# EasyEDA Pro project SCH_and_PCB.epro, board PCB_PCB_四路运放_2023-06-19
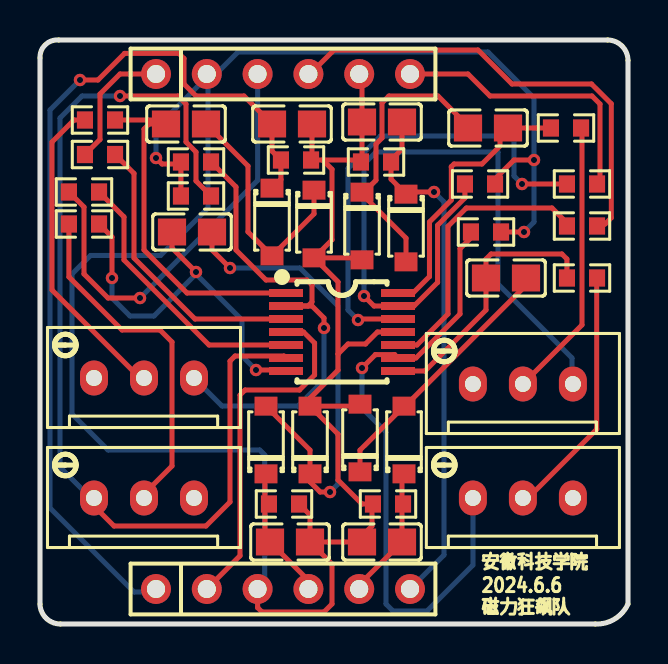
[diagram p14: board, top side]
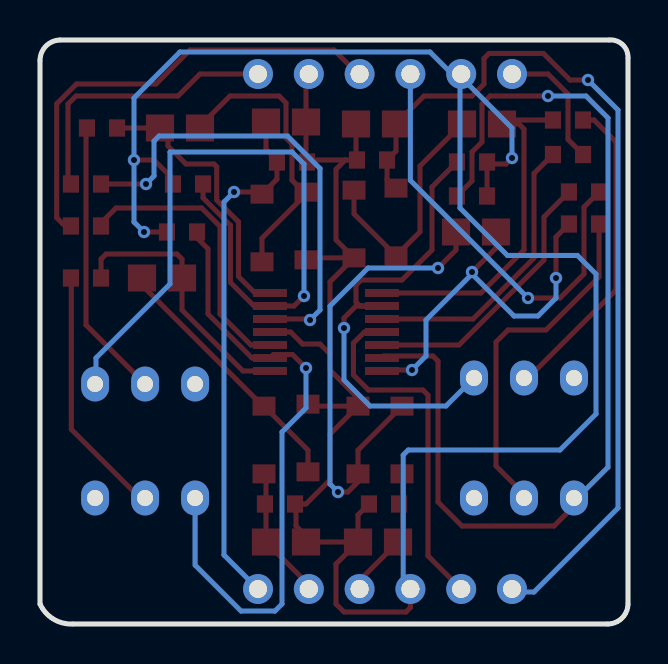
[diagram p15: board, bottom side, seen from below]

Outline 29.4 x 29.2 mm; copper layers: Top Layer, Bottom Layer. Coordinates in mm from the lower left corner of the outline.
Outline path: 0,28.3 arc(0.27,28.96) 0.94,29.2 28.39,29.2 arc(29.1,28.9) 29.4,28.18 29.4,1 arc(28.74,0.25) 27.77,0 1.02,0 arc(0.31,0.29) 0,1 0,28.3
Stack: Top Layer 0.035mm / Dielectric1 1.51mm FR4 er 4.5 / Bottom Layer 0.035mm

## Design rules (mm)
spacing Default (default): track to track 0.152, other pairs 0 to 0.152
track width Default (default): min 0.152, default 0.152, max 25.4
differential pair differentialPair (default): width min 0.127, default 0.254, max 2.54; gap min 0.152, default 0.152
via Default (default): diameter min 0.62, default 0.62, max 100.025; hole min 0.305, default 0.305, max 59.995
net GND uses gge8511

## Placement (name value [footprint] x y rotation side)
C1  104  [C0805]  7.3 25 0 top
C2  104  [C0805]  12.6 25 180 top
C3  104  [C0805]  7.6 19.6 180 top
C4  104  [C0805]  12.5 4.1 180 top
C5  104  [C0805]  23.3 17.3 0 top
C6  104  [C0805]  17.1 4.1 180 top
C7  104  [C0805]  22.4 24.8 0 top
C8  104  [C0805]  17.1 25.1 180 top
D1  B5819W  [SOD-123_L2.8-W1.8-LS3.7-RD]  11.6 20.1 270 top
D2  B5819W  [SOD-123_L2.8-W1.8-LS3.7-RD]  13.7 20 270 top
D3  B5819W  [SOD-123_L2.8-W1.8-LS3.7-RD]  11.3 9.2 90 top
D4  B5819W  [SOD-123_L2.8-W1.8-LS3.7-RD]  13.5 9.2 90 top
D5  B5819W  [SOD-123_L2.8-W1.8-LS3.7-RD]  18.2 9.2 90 top
D6  B5819W  [SOD-123_L2.8-W1.8-LS3.7-RD]  16 9.3 90 top
D7  B5819W  [SOD-123_L2.8-W1.8-LS3.7-RD]  18.3 19.8 270 top
D8  B5819W  [SOD-123_L2.8-W1.8-LS3.7-RD]  16.1 19.9 270 top
P1  Header-D-M 1x6P  [HDR1X6-M]  5.8 27.5 0 top
P2  Header-D-M 1x6P  [HDR1X6-M]  5.8 1.75 0 top
R1  5.1K  [R0603]  3 23.47 0 top
R2  1K  [R0603]  7.8 23.1 0 top
R3  47K  [R0603]  3 25.2 0 top
R4  47k  [R0603]  12.8 23.2 180 top
R5  5.1k  [R0603]  2.2 21.6 0 top
R6  1k  [R0603]  7.8 21.4 0 top
R7  47k  [R0603]  2.2 20 0 top
R8  47K  [R0603]  12.2 6 180 top
R9  5.1K  [R0603]  27.1 19.9 0 top
R10  1K  [R0603]  22.3 19.6 0 top
R11  47K  [R0603]  27.1 17.3 0 top
R12  47k  [R0603]  17.4 6 180 top
R13  5.1K  [R0603]  27.1 22 0 top
R14  1K  [R0603]  22 22 0 top
R15  47k  [R0603]  26.3 24.8 0 top
R16  47k  [R0603]  16.8 23.1 180 top
RP1  100K  [RES-ADJ-TH_3296W-1-203]  5.2 12.3 180 top
RP2  100K  [RES-ADJ-TH_3296W-1-203]  5.2 6.3 180 top
RP3  100K  [RES-ADJ-TH_3296W-1-203]  24.14 12 180 top
RP4  100K  [RES-ADJ-TH_3296W-1-203]  24.14 6.3 180 top
U2  OPA4377AIPW  [TSSOP-14_L5.0-W4.4-P0.65-LS6.4-BL]  15.1 14.6 270 top

## Footprints (pads in the part's own frame, mm; a bottom-side part is the same pattern mirrored in y, then rotated)
C0805
  rect 1.41x1.35 smd: 1(-1,0) 2(1,0)
HDR1X6-M
  round 1.5 hole 0.905x0.9: 1(0,0) 2(2.54,0) 3(5.08,0) 4(7.62,0) 5(10.16,0) 6(12.7,0)
R0603
  rect 0.806x0.864 smd: 1(-0.753,0) 2(0.753,0)
RES-ADJ-TH_3296W-1-203
  oval 1.4x1.75 hole 0.8: 1(-2.5,0) 2(0,0) 3(2.5,0)
SOD-123_L2.8-W1.8-LS3.7-RD
  rect 0.95x1.15 smd: 1(-1.692,0) 2(1.692,0)
TSSOP-14_L5.0-W4.4-P0.65-LS6.4-BL
  rect 0.4x1.7 smd: 1(-1.95,-2.8) 2(-1.3,-2.8) 3(-0.65,-2.8) 4(0,-2.8) 5(0.65,-2.8) 6(1.3,-2.8) 7(1.95,-2.8) 8(1.95,2.8) 9(1.3,2.8) 10(0.65,2.8) 11(0,2.8) 12(-0.65,2.8) 13(-1.3,2.8) 14(-1.95,2.8)

## Nets
+5V: P2.2 U2.4
GND: C2.1 C4.1 C6.2 C8.2 D2.2 D4.2 D6.2 D8.2 P1.2 P1.5 P2.3 R2.1 R4.1 R6.1 R8.1 R10.2 R12.2 R14.2 R16.2 U2.11
C1_2: C1.2 D1.2 D2.1
C5_2: C5.2 D5.2 D6.1
D3_2: C3.1 D3.2 D4.1
D7_2: C7.1 D7.2 D8.1
IN1: P1.1 R1.1
IN2: P1.3 R5.1
IN3: P1.4 R9.2
IN4: P1.6 R13.2
OPA1: C1.1 R3.2 U2.1
OPA2: R2.2 RP1.1 U2.2
OPA3: R1.2 U2.3
OPA5: R5.2 U2.5
OPA6: R6.2 RP2.3 U2.6
OPA7: C3.2 R7.2 U2.7
OPA8: C5.1 R11.1 U2.8
OPA9: R10.1 RP4.3 U2.9
OPA10: R9.1 U2.10
OPA12: R13.1 U2.12
OPA13: R14.1 RP3.1 U2.13
OPA14: C7.2 R15.1 U2.14
OUT1: C2.2 D1.1 P2.1 R4.2
OUT2: C4.2 D3.1 P2.4 R8.2
OUT3: C6.1 D5.1 P2.5 R12.1
OUT4: C8.1 D7.1 P2.6 R16.1
RP1_2: R3.1 RP1.2
RP2_2: R7.1 RP2.2
RP3_2: R15.2 RP3.2
RP4_2: R11.2 RP4.2

Pads without a net: RP1 3; RP2 1; RP3 3; RP4 1

## Via types
v1: diameter 0.62, hole 0.305, Top Layer to Bottom Layer, 17 vias

## Routing (per net, layer and track width the routed paths; a pad name or vN(x,y) marks a point on that pad's centre or on a via; arc(x,y) is an arc through that point)
+5V: length 17.8
  Top Layer w0.254: P2.2 10,3.41 10,11.45 10.25,11.7 12.97,11.7 13.73,12.45 13.73,14.05 13.17,14.6 U2.4
GND: length 128.3
  Top Layer w0.254: P2.3 10.88,0.82 11.1,0.6 14.2,0.6 14.6,1 14.6,3 C4.1 ; 12.95,6 13.5,5.45 C4.1 ; v1(5.8,23.3) 6.1,23 6.95,23 R2.1 R6.1 ; 22.75,22 22.75,22.25 23.7,23.2 v1(24.7,23.2) ; 16.1,27.16 C8.2 16.1,23.25 16.05,23.2 R16.2 15.95,23.2 14.13,23.2 ; 14.13,23.2 14.6,22.73 14.6,19.21 D2.2 ; 14.13,23.2 13.55,23.2 13.6,23.25 C2.1 ; 14.9,13.5 15.4,14 16.27,14 16.87,14.6 U2.11 ; 14.9,13.5 14.9,12.69 13.5,11.29 D4.2 ; 14.9,13.5 14.9,17.11 D2.2 ; C4.1 C6.2 16.1,4.4 16.6,4.9 16.6,5.75 16.85,6 16.1,6 14.9,7.2 14.9,9.49 D4.2 ; D4.2 15.9,10.89 D6.2 ; v1(24.2,19.6) 23.45,19.6 ; D2.2 15.9,18.31 16.1,18.11
  Bottom Layer w0.254: v1(5.8,23.3) 5.8,24.8 8.34,27.34 P1.2 ; P2.3 11.24,2.11 11.24,8.45 10.99,8.7 3.4,8.7 1.6,10.5 1.6,17.5 2.53,18.43 6.03,18.43 8.4,20.8 8.4,27.1 9.9,28.6 22.4,28.6 24.7,26.3 v1(24.7,23.2) 24.7,20.1 v1(24.2,19.6)
C1_2: length 12.1
  Top Layer w0.254: C1.2 10.4,22.9 10.4,19.61 D1.2 13.7,20.51 D2.1
C5_2: length 13.2
  Top Layer w0.254: C5.2 24.2,17.2 24.2,16.84 18.25,10.89 D5.2 16,8.69 D6.1
D3_2: length 23.7
  Top Layer w0.254: v1(9.5,17.8) 8.6,18.7 C3.1 ; v1(14.5,6.6) 14.01,6.6 13.5,7.11 D4.1 13.5,8.69 D3.2
  Bottom Layer w0.254: v1(14.5,6.6) 14.9,7 14.9,15.9 13,17.8 v1(9.5,17.8)
D7_2: length 14.4
  Top Layer w0.254: D7.2 18.3,19.29 16.1,21.49 16.8,22.19 16.8,24 17.1,24.3 17.1,26.05 17.45,26.4 19.9,26.4 21.4,24.9 C7.1
IN1: length 6.6
  Top Layer w0.254: P1.1 4,27.5 3,26.5 3,24.23 R1.1
IN2: length 21.3
  Top Layer w0.254: R5.1 2.2,20.85 2.2,17.5 3.4,16.3 v1(5,16.3)
  Bottom Layer w0.254: v1(5,16.3) 10.88,22.18 P1.3
IN3: length 22.9
  Top Layer w0.254: 28.15,20 28.25,20 28.56,20.31 28.56,26.01 27.57,27 23.6,27 21.9,28.7 14.7,28.7 13.5,27.5
IN4: length 14.3
  Top Layer w0.254: P1.6 21.4,27.5 22.5,26.4 27.6,26.4 28,26 28,21.85
OPA1: length 17.9
  Top Layer w0.254: U2.1 7.35,16.55 5.2,18.7 5.2,24.75 5.45,25 C1.1 6.1,25.2 R3.2
OPA2: length 24.8
  Top Layer w0.254: R2.2 9.8,21.85 9.8,18.7 11.3,17.2 13.35,17.2 13.6,16.95 13.6,16.1 13.4,15.9 U2.2 13.6,15.9 14.2,15.3 v1(14.2,14.8)
  Bottom Layer w0.254: 7.5,12.5 9.1,10.9 12.9,10.9 14.2,12.2 v1(14.2,14.8)
OPA3: length 14.4
  Top Layer w0.254: U2.3 7.75,15.25 4.7,18.3 4.7,22.53 R1.2
OPA5: length 13.8
  Top Layer w0.254: R5.2 4.2,20.35 4.2,18.2 8.45,13.95 U2.5
OPA6: length 50.1
  Top Layer w0.254: 2.7,6.5 2.7,5.9 3.7,4.9 8.3,4.9 9.5,6.1 9.5,13.15 9.75,13.4 12.2,13.4 U2.6 ; R6.2 7.8,22.15 7.8,23.6 7.3,24.1 7.3,26 6.9,26.4 v1(4,26.4)
  Bottom Layer w0.254: 2.7,6.5 2.34,6.5 1,7.84 1,25.3 2.1,26.4 v1(4,26.4)
OPA7: length 19.6
  Top Layer w0.254: v1(3.6,17.3) 3.6,19.35 R7.2 ; U2.7 12.25,12.7 v1(10.8,12.7) ; C3.2 6.6,18.8 v1(7.8,17.6)
  Bottom Layer w0.254: v1(3.6,17.3) 3.6,16.3 4.5,15.4 5.7,15.4 7.8,17.5 ; 7.8,17.5 10.1,15.2 10.1,13.4 v1(10.8,12.7) ; 7.8,17.5 v1(7.8,17.6)
OPA8: length 13.4
  Top Layer w0.254: R11.1 26.35,18.25 26.09,18.5 22.55,18.5 22.3,18.25 C5.1 22.3,15.7 19.25,12.65 U2.8
OPA9: length 31.7
  Top Layer w0.254: 21.65,19.7 R10.1 21.55,19.31 21,18.76 21,15.5 18.8,13.3 U2.9 17.73,13.47 16.77,13.47 v1(16.1,12.8)
  Bottom Layer w0.254: v1(16.1,12.8) 16.1,10.8 17.3,9.6 17.3,1 17.65,0.65 19.35,0.65 21.65,2.95 RP4.3
OPA10: length 14.2
  Top Layer w0.254: U2.10 18.85,13.95 20.4,15.5 20.4,19.88 21.32,20.8 25.6,20.8 26.4,20
OPA12: length 23.3
  Top Layer w0.254: v1(24.1,22) 26.25,22 ; v1(15.9,15.2) 15.95,15.25 U2.12
  Bottom Layer w0.254: v1(15.9,15.2) 15.4,15.7 15.4,22.77 17.03,24.4 23.45,24.4 23.7,24.15 23.7,22.4 v1(24.1,22)
OPA13: length 36.2
  Top Layer w0.254: R14.1 21.25,21.3 19.88,19.94 19.88,17.08 18.7,15.9 U2.13 16.7,15.9 v1(16.2,16.4)
  Bottom Layer w0.254: 26.9,12.5 26.6,12.8 26.6,13.3 22.9,17 22.9,23.6 16.8,23.6 16.2,23 v1(16.2,16.4)
OPA14: length 13.9
  Top Layer w0.254: U2.14 18.65,16.55 19.47,17.37 19.47,20.11 20.56,21.2 20.56,22.86 20.7,23 22.1,23 23,23.9 23,24.4 C7.2 R15.1
OUT1: length 45.4
  Top Layer w0.254: v1(2,27.2) 2.9,27.2 4.23,28.53 6.95,28.53 7.2,28.28 7.2,27 7.8,26.4 10.2,26.4 C2.2 11.6,23.65 R4.2 12.05,22.24 D1.1
  Bottom Layer w0.254: P2.1 5.95,1.6 4.7,1.6 0.5,5.8 0.5,25.7 v1(2,27.2)
OUT2: length 6.7
  Top Layer w0.254: P2.4 13.42,2.18 C4.2 11.25,4.35 11.25,7.45 D3.1
OUT3: length 6.7
  Top Layer w0.254: P2.5 15.96,1.96 C6.1 18.1,7.41 D5.1
OUT4: length 26.4
  Top Layer w0.254: C8.1 18.1,23.75 17.55,23.2 17.55,22.24 D7.1 18.41,21.6 v1(19.7,21.6)
  Bottom Layer w0.254: v1(19.7,21.6) 20.2,21.1 20.2,3.45 P2.6
RP1_2: length 15.9
  Top Layer w0.254: R3.1 1.7,25.2 0.6,24.1 0.6,16.7 5,12.3 RP1.2
RP2_2: length 17.5
  Top Layer w0.254: R7.1 1.45,17.35 4.1,14.7 6,14.7 6.6,14.1 6.6,7.9 5.2,6.5 RP2.2
RP3_2: length 14.3
  Top Layer w0.254: 27.25,25.05 27.1,24.9 27.1,14.95 RP3.2
RP4_2: length 12.7
  Top Layer w0.254: RP4.2 24.4,6.3 27.84,9.73 27.84,17.33

## Text on the board
Top Silkscreen Layer: 安徽科技学院 / 2024.6.6 / 磁力狂飙队
